# Altium schematic sheet Tree.SchDoc
size B; SheetNumber: 1; SheetTotal: 6
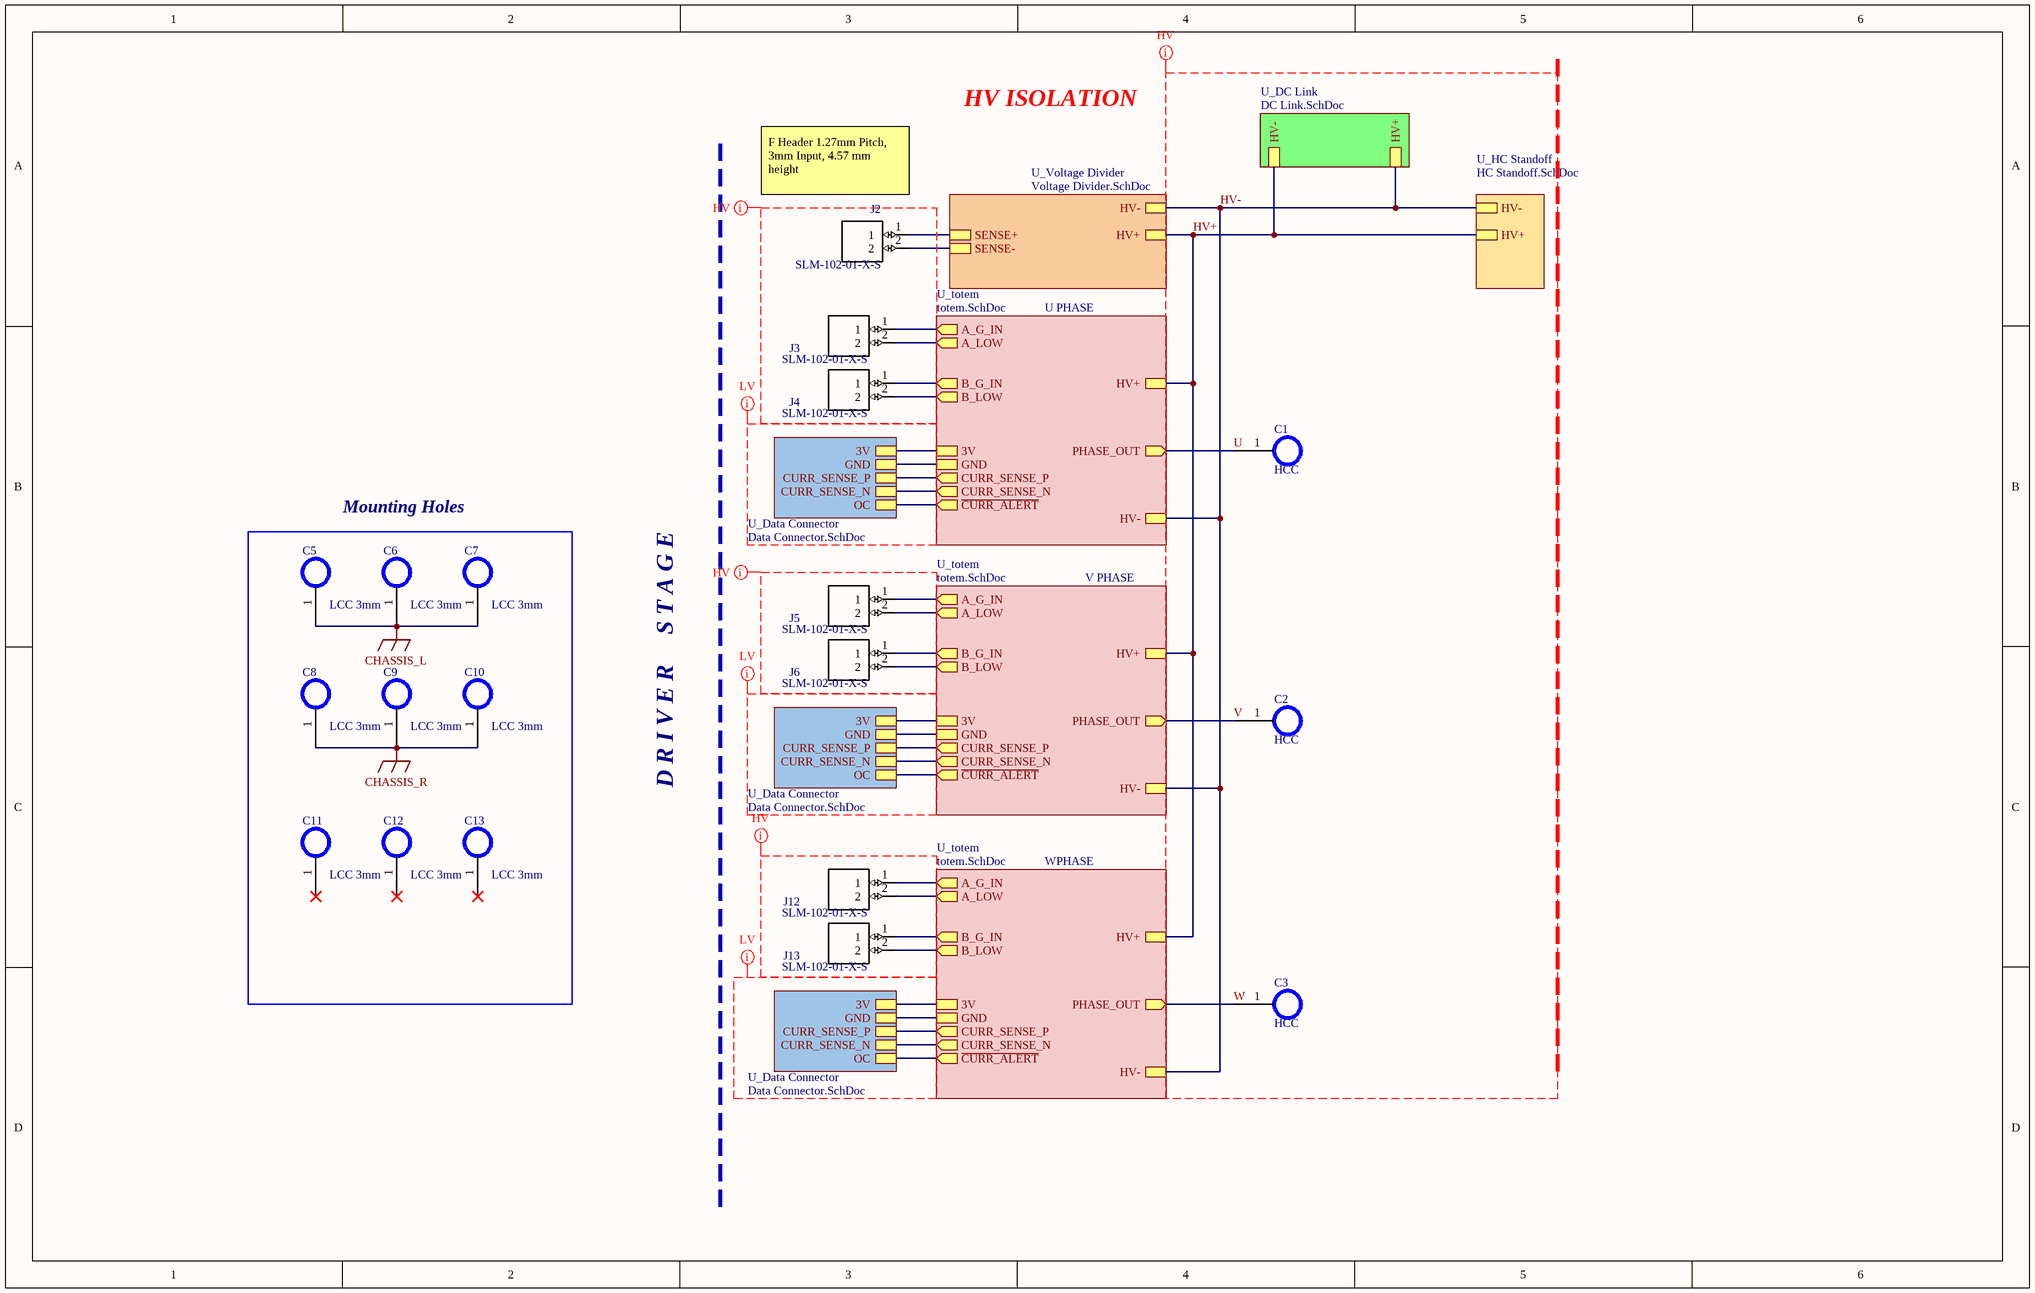
[diagram p0: Tree.SchDoc]

## Parts
C1  HCC  [6mm Pad]
C2  HCC  [6mm Pad]
C3  HCC  [6mm Pad]
C5  LCC 3mm  [PAD 3MM]
C6  LCC 3mm  [PAD 3MM]
C7  LCC 3mm  [PAD 3MM]
C8  LCC 3mm  [PAD 3MM]
C9  LCC 3mm  [PAD 3MM]
C10  LCC 3mm  [PAD 3MM]
C11  LCC 3mm  [PAD 3MM]
C12  LCC 3mm  [PAD 3MM]
C13  LCC 3mm  [PAD 3MM]
J2  SLM-102-01-X-S  [*SLM-102-01-X-S]
J3  SLM-102-01-X-S  [*SLM-102-01-X-S]
J4  SLM-102-01-X-S  [*SLM-102-01-X-S]
J5  SLM-102-01-X-S  [*SLM-102-01-X-S]
J6  SLM-102-01-X-S  [*SLM-102-01-X-S]
J12  SLM-102-01-X-S  [*SLM-102-01-X-S]
J13  SLM-102-01-X-S  [*SLM-102-01-X-S]

## Blocks framed on the sheet
Mounting Holes: C5-C13

## Sub-sheets
U_Data Connector = Data Connector.SchDoc: GND, OC, 3V, CURR_SENSE_P, CURR_SENSE_N
U_Data Connector = Data Connector.SchDoc: GND, OC, 3V, CURR_SENSE_P, CURR_SENSE_N
U_Data Connector = Data Connector.SchDoc: GND, OC, 3V, CURR_SENSE_P, CURR_SENSE_N
U_DC Link = DC Link.SchDoc: HV+, HV-
U_HC Standoff = HC Standoff.SchDoc: HV+, HV-
U_totem = totem.SchDoc: PHASE_OUT (out), B_LOW (out), B_G_IN (out), A_LOW (out), A_G_IN (out), ~{CURR_ALERT} (out), HV+, HV-, 3V, GND, CURR_SENSE_P (out), CURR_SENSE_N (out)
U_totem = totem.SchDoc: PHASE_OUT (out), B_LOW (out), B_G_IN (out), A_LOW (out), A_G_IN (out), ~{CURR_ALERT} (out), HV+, HV-, 3V, GND, CURR_SENSE_P (out), CURR_SENSE_N (out)
U_totem = totem.SchDoc: PHASE_OUT (out), B_LOW (out), B_G_IN (out), A_LOW (out), A_G_IN (out), ~{CURR_ALERT} (out), HV+, HV-, 3V, GND, CURR_SENSE_P (out), CURR_SENSE_N (out)
U_Voltage Divider = Voltage Divider.SchDoc: HV+, HV-, SENSE+, SENSE-  | ClassName: U PHASE

## Nets
CHASSIS_L: C5.1 C6.1 C7.1
CHASSIS_R: C8.1 C9.1 C10.1
HV+: sheet U_HC Standoff/HV+, sheet U_Voltage Divider/HV+, sheet U_DC Link/HV-, sheet U_totem/HV+, sheet U_totem/HV+, sheet U_totem/HV+
HV-: sheet U_HC Standoff/HV-, sheet U_Voltage Divider/HV-, sheet U_DC Link/HV+, sheet U_totem/HV-, sheet U_totem/HV-, sheet U_totem/HV-
U: C1.1 ; sheet U_totem/PHASE_OUT
V: C2.1 ; sheet U_totem/PHASE_OUT
W: C3.1 ; sheet U_totem/PHASE_OUT
NetJ2_1: J2.1 ; sheet U_Voltage Divider/SENSE+
NetJ2_2: J2.2 ; sheet U_Voltage Divider/SENSE-
NetJ3_1: J3.1 ; sheet U_totem/A_G_IN
NetJ3_2: J3.2 ; sheet U_totem/A_LOW
NetJ4_1: J4.1 ; sheet U_totem/B_G_IN
NetJ4_2: J4.2 ; sheet U_totem/B_LOW
NetJ5_1: J5.1 ; sheet U_totem/A_G_IN
NetJ5_2: J5.2 ; sheet U_totem/A_LOW
NetJ6_1: J6.1 ; sheet U_totem/B_G_IN
NetJ6_2: J6.2 ; sheet U_totem/B_LOW
NetJ12_1: J12.1 ; sheet U_totem/A_G_IN
NetJ12_2: J12.2 ; sheet U_totem/A_LOW
NetJ13_1: J13.1 ; sheet U_totem/B_G_IN
NetJ13_2: J13.2 ; sheet U_totem/B_LOW
(unnamed): sheet U_Data Connector/GND, sheet U_totem/GND
(unnamed): sheet U_Data Connector/OC, sheet U_totem/~{CURR_ALERT}
(unnamed): sheet U_Data Connector/3V, sheet U_totem/3V
(unnamed): sheet U_Data Connector/CURR_SENSE_P, sheet U_totem/CURR_SENSE_P
(unnamed): sheet U_Data Connector/CURR_SENSE_N, sheet U_totem/CURR_SENSE_N
(unnamed): sheet U_Data Connector/GND, sheet U_totem/GND
(unnamed): sheet U_Data Connector/OC, sheet U_totem/~{CURR_ALERT}
(unnamed): sheet U_Data Connector/3V, sheet U_totem/3V
(unnamed): sheet U_Data Connector/CURR_SENSE_P, sheet U_totem/CURR_SENSE_P
(unnamed): sheet U_Data Connector/CURR_SENSE_N, sheet U_totem/CURR_SENSE_N
(unnamed): sheet U_Data Connector/GND, sheet U_totem/GND
(unnamed): sheet U_Data Connector/OC, sheet U_totem/~{CURR_ALERT}
(unnamed): sheet U_Data Connector/3V, sheet U_totem/3V
(unnamed): sheet U_Data Connector/CURR_SENSE_P, sheet U_totem/CURR_SENSE_P
(unnamed): sheet U_Data Connector/CURR_SENSE_N, sheet U_totem/CURR_SENSE_N

Not connected (* = marked no-connect by the designer): C11 1*; C12 1*; C13 1*

## Layout directives
net class HV: (no net found under the mark), HV+, HV-, U, V, W
net class LV: (no net found under the mark)

## Notes on the sheet
- HV ISOLATION
- (near J2) F Header 1.27mm Pitch, 3mm Input, 4.57 mm height
- U PHASE
- V PHASE
- D R I V E R     S T A G E
- WPHASE
- MY
- Project
- Author
- Revision
- Sheet
- Modified
- of

## Library data of the parts
J2-J6 J12 J13 = SLM-102-01-X-S: Value: *